# EAGLE design rapidshark-h-bridge-mk-1.0 (EAGLE 6.5.0)
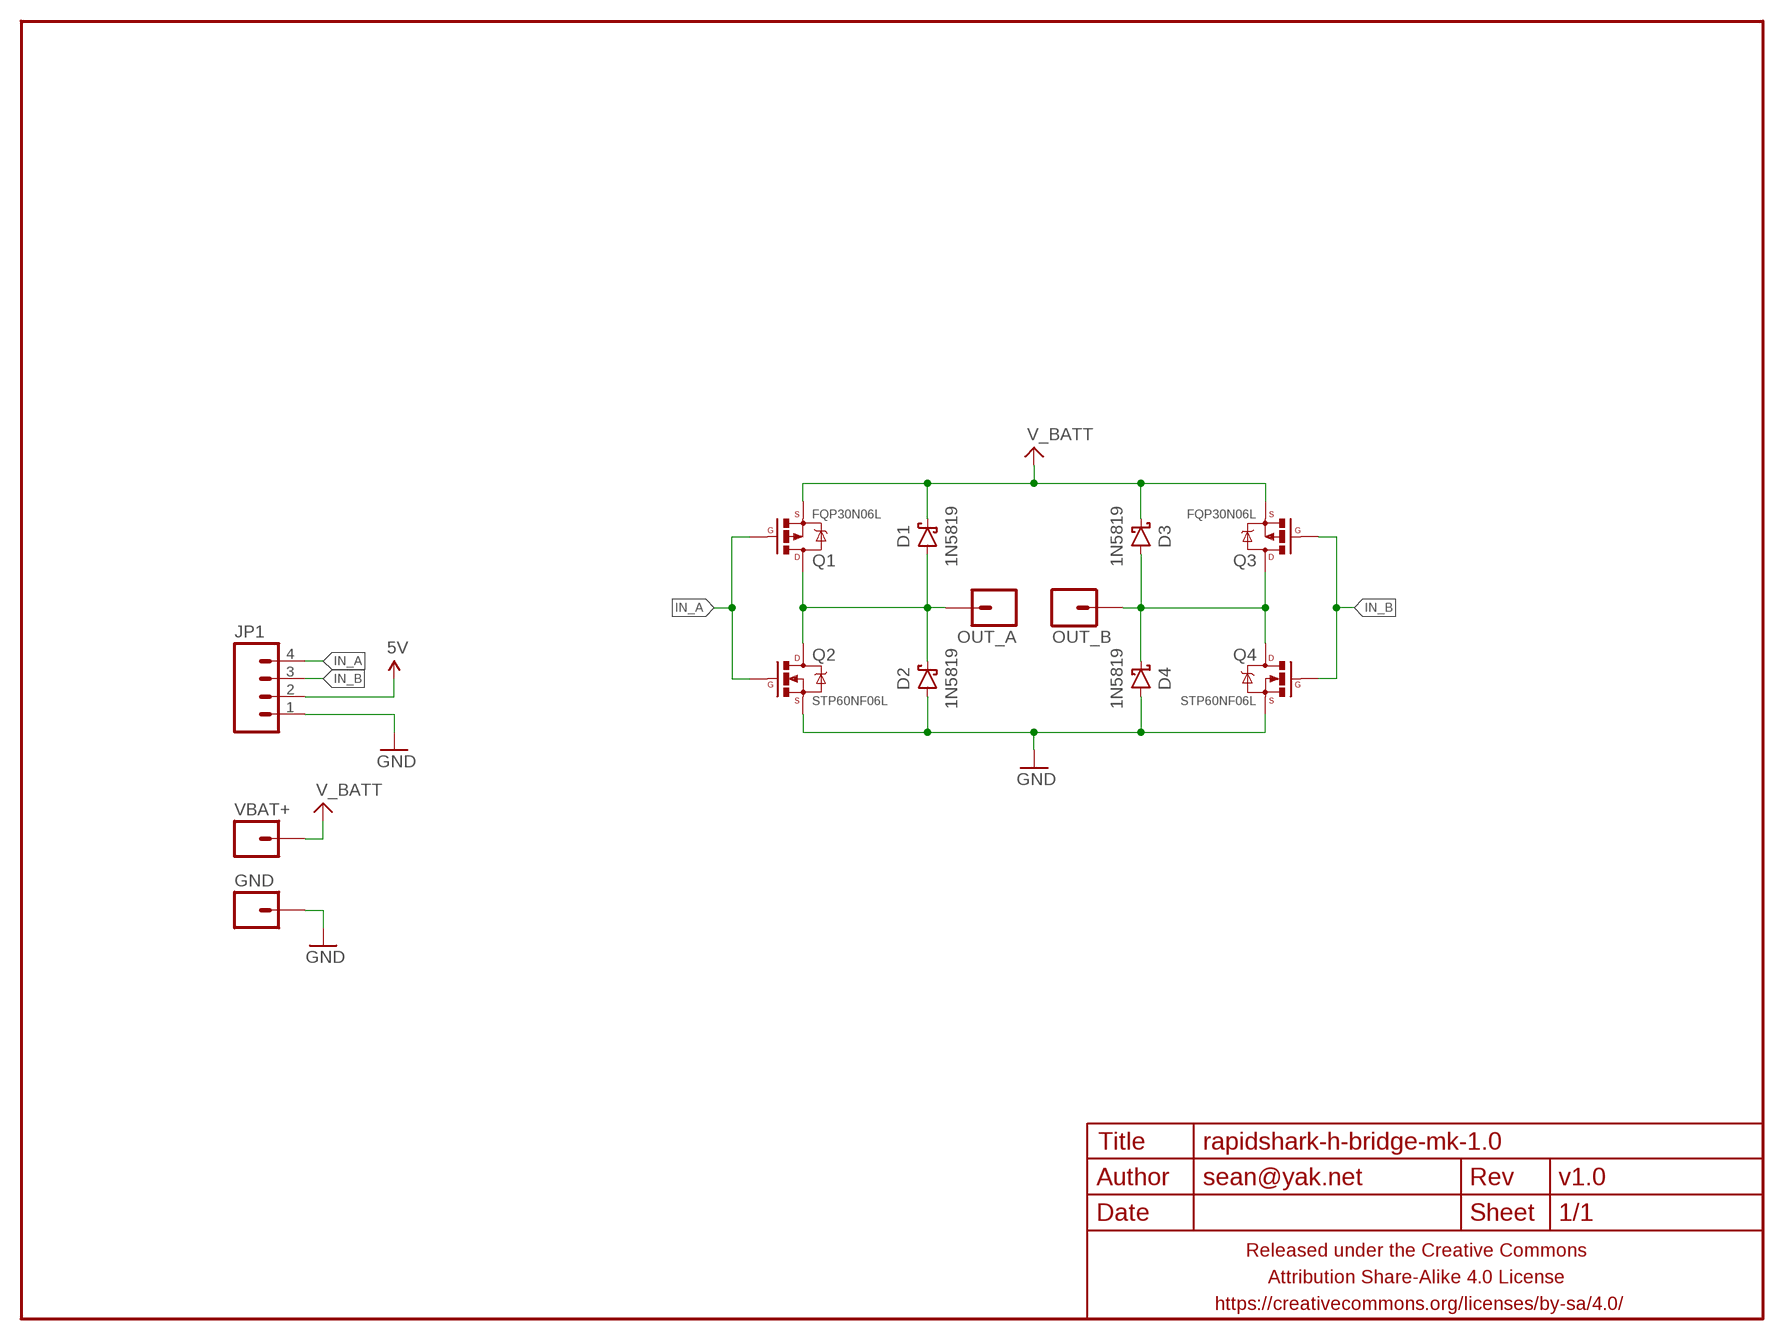
[diagram p0: schematic, sheet 1]

## Parts
D1  1N5819  DIODE-SCHOTTKYPTH-10.16MM  [DIODE-SCHOTTKY-10.16MM]
D2  1N5819  DIODE-SCHOTTKYPTH-10.16MM  [DIODE-SCHOTTKY-10.16MM]
D3  1N5819  DIODE-SCHOTTKYPTH-10.16MM  [DIODE-SCHOTTKY-10.16MM]
D4  1N5819  DIODE-SCHOTTKYPTH-10.16MM  [DIODE-SCHOTTKY-10.16MM]
FRAME1  FRAME-LETTERNO_PACKAGE  [DUMMY]
GND  M0112AWG  [1X01-12AWG]
JP1  M04PTH  [1X04-PTH-VERT]
OUT_A  M0112AWG  [1X01-12AWG]
OUT_B  M0112AWG  [1X01-12AWG]
Q1  FQP30N06L  MOSFET-PCHANNELFQP30P06L  [TO220-THERMPAD]
Q2  STP60NF06L  MOSFET-NCHANNELTO-220  [TO220-THERMPAD]
Q3  FQP30N06L  MOSFET-PCHANNELFQP30P06L  [TO220-THERMPAD]
Q4  STP60NF06L  MOSFET-NCHANNELTO-220  [TO220-THERMPAD]
VBAT+  M0112AWG  [1X01-12AWG]

## Nets
5V: JP1.2
A: D1.A D2.C OUT_A.1 Q1.2@1(D) Q1.2@2(D) Q2.2@1(D) Q2.2@2(D)
B: D3.A D4.C OUT_B.1 Q3.2@1(D) Q3.2@2(D) Q4.2@1(D) Q4.2@2(D)
GND: D2.A D4.A GND.1 JP1.1 Q2.3(S) Q4.3(S)
IN_A: JP1.4 Q1.1(G) Q2.1(G)
IN_B: JP1.3 Q3.1(G) Q4.1(G)
V_BATT: D1.C D3.C Q1.3(S) Q3.3(S) VBAT+.1

## Library data of the parts
D1-D4 = A_butts:DIODE-SCHOTTKY: Schottky diodes in SFE's production catalog BAT20J 1A 23V 0.62Vf RB751 120mA 40V 0.37Vf PMEG4005EJ 0.5A 40V 0.42Vf MBRA140 1A 40V 0.5Vf B340A 3A 40V SMA
FRAME1 = A_butts:FRAME-LETTER: Schematic Frame Standard 8.5x11 US Letter frame; DESIGNER: sean@yak.net; VERSION: v1.0
GND OUT_A OUT_B VBAT+ = A_butts:M01: Header 1 Standard 1-pin 0.1" header. Use with straight break away headers (SKU : PRT-00116), right angle break away headers (PRT-00553), swiss pins (PRT-00743), machine pins (PRT-00117), and female headers (PRT-00115).
JP1 = A_butts:M04: Header 4 Standard 4-pin 0.1" header. Use with straight break away headers (SKU : PRT-00116), right angle break away headers (PRT-00553), swiss pins (PRT-00743), machine pins (PRT-00117), and female headers (PRT-00115). Molex polarized connector foot print use with SKU : PRT-08231 with associated crimp pins and housings. 1MM SMD Version SKU: PRT-10208
Q1 Q3 = A_butts:MOSFET-PCHANNEL: Generic PMOSFET IRLML2244 - TRANS-11153 (SOT-23 -20V -4.3A) (1.Gate 2.Source 3.Drain) FQP27P06 - COM-10349 <http://www.sparkfun.com/products/10349> (TO-220 -60V -27A) (1.Gate 2.Source 3.Drain)
Q2 Q4 = A_butts:MOSFET-NCHANNEL: Common NMOSFET Parts MFG P/N Store ID Prod ID FDD8780 TRANS-09984 SI7820DN TRANS-11055 FDS6630A IC-08089 2N7002PW TRANS-11151 FQP30N06L COM-10213 TRANS-10060 BSS123LT1G TRANS-08345 BSS138 TRANS-00830 BS170 2N7000

## Board
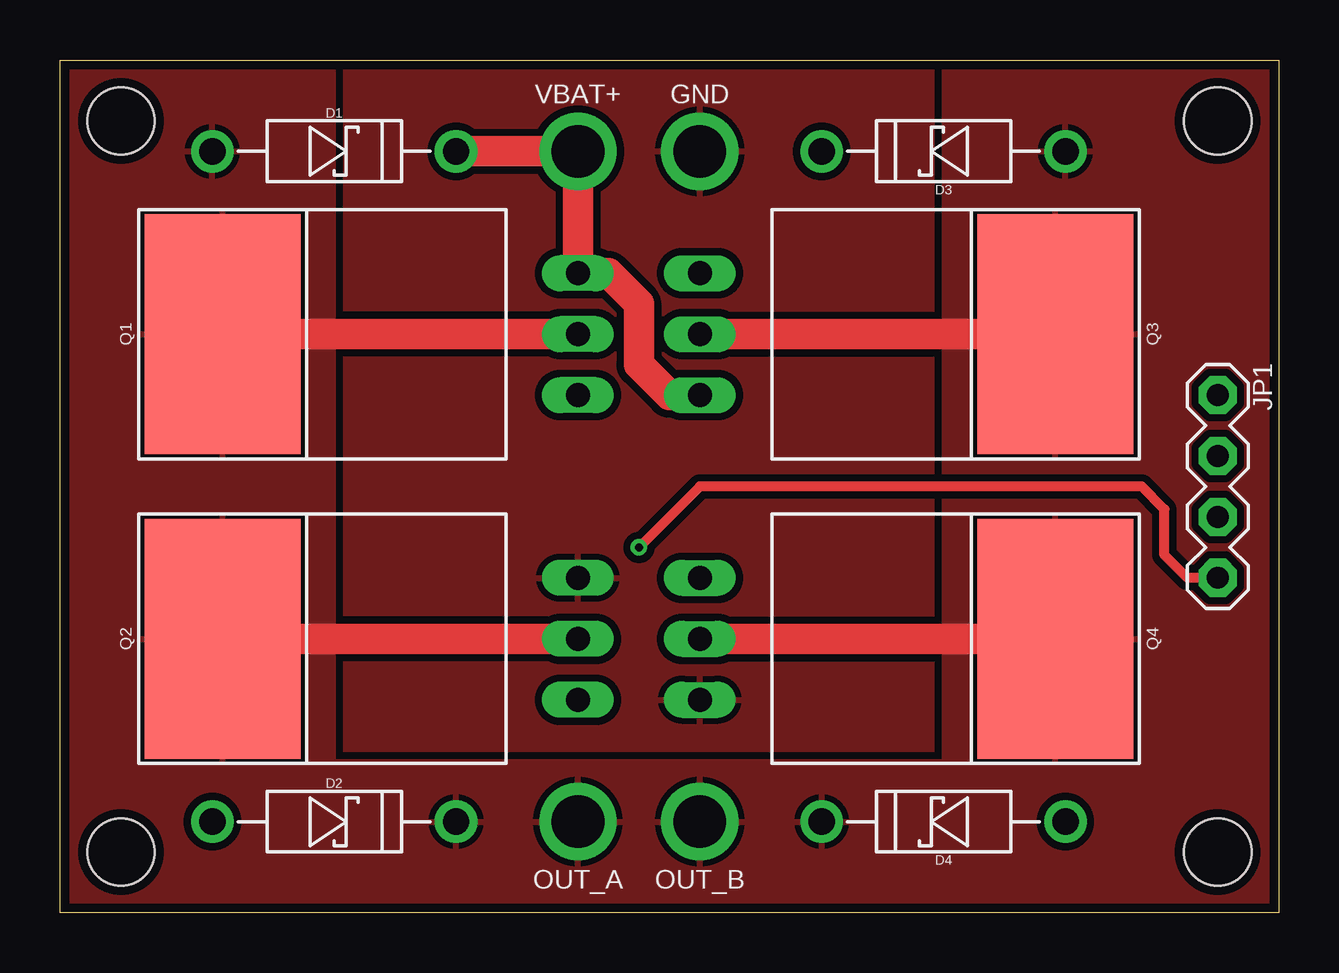
[diagram p1: board, top side]
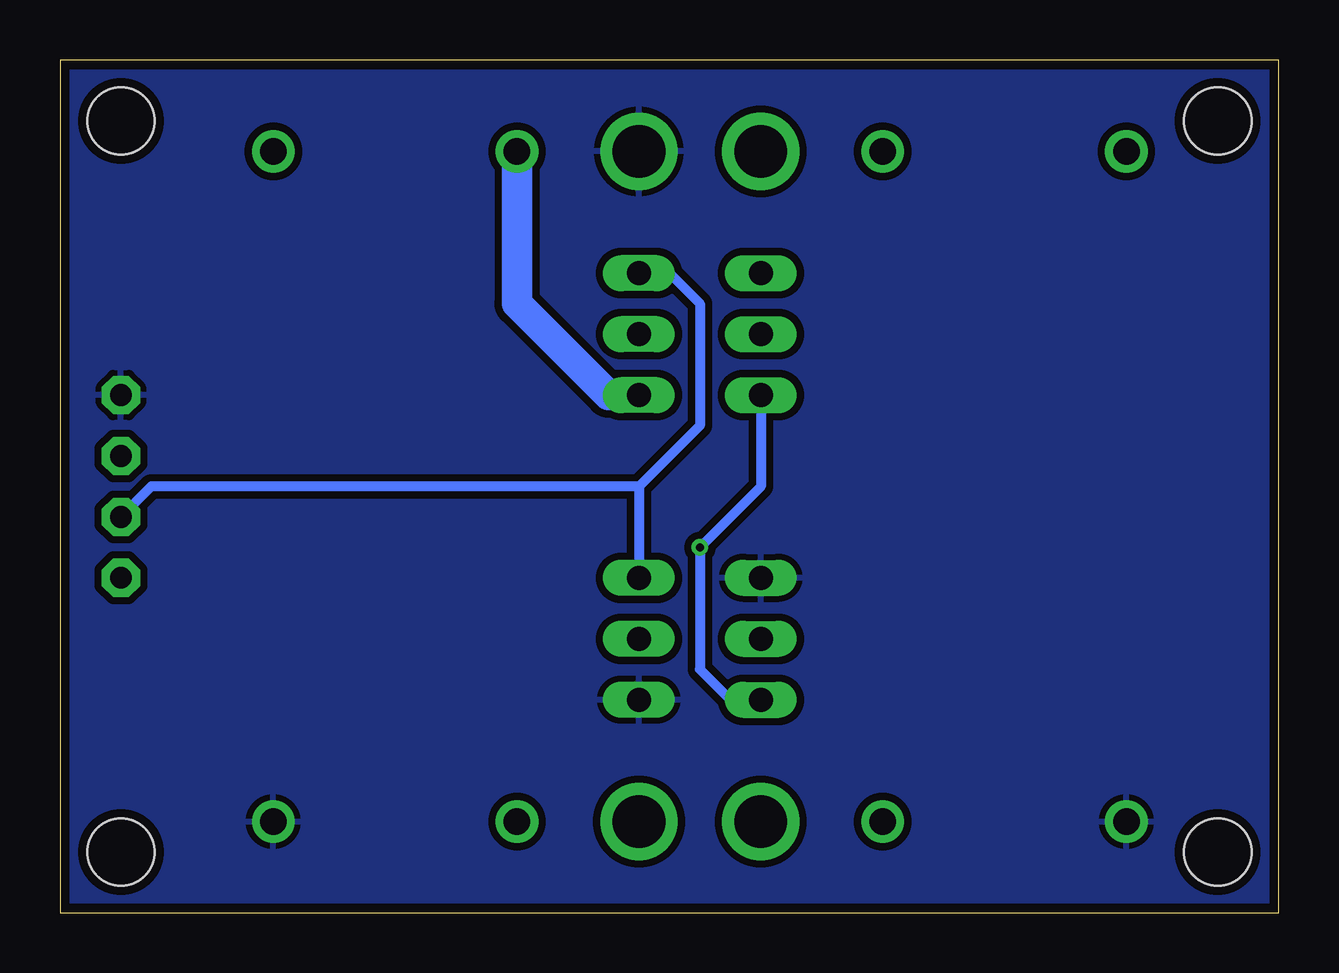
[diagram p2: board, bottom side, seen from below]

Size 50.8 x 35.56 mm. Coordinates in mm from the lower left corner, seen from the top.
Outline: 50.8,35.56 50.8,0 0,0 0,35.56 50.8,35.56
Copper layers (1*16): Top 0.0356mm / dielectric 1.5011mm / Bottom 0.0356mm
Design rules "LaenPCBOrder_2": minimum track width 6mil, minimum drill 13mil, track to track 6mil, track to pad 6mil, pad to pad 6mil, via to via 6mil, smd to smd 6mil, copper to edge 15mil, drill to drill 6mil, minimum pad ring 7mil, minimum via ring 7mil, stop-mask expansion 3mil, vias tented up to drill 20mil, thermal gap 10mil
Holes 2.8 mm at 2.54,2.54 48.26,2.54 48.26,33.02 2.54,33.02

### Footprints (pad centres in the part's own frame; a part is rotated, then mirrored left to right if it is on the bottom)
DIODE-SCHOTTKY-10.16MM = drill 1.1 pad 1.778: A -5.08,0; C 5.08,0
1X01-12AWG = drill 2.2 pad 3.2: 1 0,0
1X04-PTH-VERT = drill 0.9 pad 1.6 octagon: 1 0,0; 2 2.54,0; 3 5.08,0; 4 7.62,0
TO220-THERMPAD = drill 1 long: 1 -2.54,0; 2@2 0,0; 3 2.54,0 | smd 10 x 6.5: 2@1 0,14.81

### Placement (x,y rotation side)
D1  11.43,31.75 0 top
D2  11.43,3.81 0 top
D3  36.83,31.75 180 top
D4  36.83,3.81 180 top
FRAME1  0,0 0 bottom
GND  26.67,31.75 0 top
JP1  48.26,21.59 270 top
OUT_A  21.59,3.81 180 top
OUT_B  26.67,3.81 180 top
Q1  21.59,24.13 90 top
Q2  21.59,11.43 90 top
Q3  26.67,24.13 270 top
Q4  26.67,11.43 270 top
VBAT+  21.59,31.75 0 top

### Tracks (layer width: path | path; a pad name or v marks a point on that pad's centre or on a via)
A
  Top 1.27: Q1.2@2 Q1.2@1 | Q2.2@2 Q2.2@1
  pour Top (isolate 0.305, rank 5): 0,35.56 0,0 24.13,0 24.13,6.35 11.43,6.35 11.43,35.56
B
  Top 1.27: Q4.2@2 Q4.2@1 | Q3.2@2 Q3.2@1
  pour Top (isolate 0.305, rank 5): 24.13,0 24.13,6.35 36.83,6.35 36.83,35.56 50.8,35.56 50.8,0
GND
  pour Top (isolate 0.305, rank 6): 0,0 0,35.56 50.8,35.56 50.8,0
  pour Bottom (isolate 0.305, rank 6): 0,0 0,35.56 50.8,35.56 50.8,0
IN_A  (via drill 0.33)
  Top 0.406: JP1.4 46.99,13.97 46.04,14.92 46.04,16.83 45.09,17.78 26.67,17.78 v24.13,15.24
  Bottom 0.406: Q1.1 21.59,17.78 v24.13,15.24 24.13,10.16 22.86,8.89 Q2.1
IN_B
  Bottom 0.406: Q3.1 25.4,26.67 24.13,25.4 24.13,20.32 26.67,17.78 | 26.67,17.78 Q4.1 | 26.67,17.78 46.99,17.78 JP1.3
V_BATT
  Top 1.27: D1.C VBAT+.1 Q1.3 22.86,26.67 24.13,25.4 24.13,22.86 25.4,21.59 Q3.3
  Bottom 1.27: D3.C 31.75,25.4 27.94,21.59 Q3.3